# Altium schematic sheet Sheet2.SchDoc
size A4; SheetNumber: 1; SheetTotal: 1
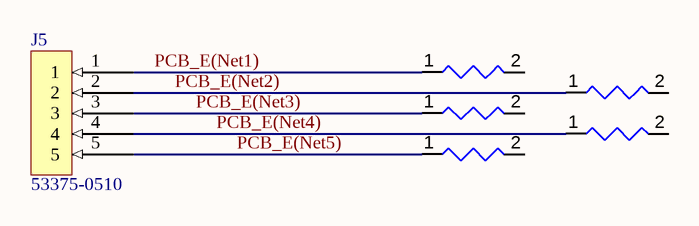
[diagram p0: Sheet2.SchDoc]

## Parts
J5  53375-0510  [53375-0510-Footprint-1]
R1  Resistor 10k +/-1% 1206 250 mW  [RESC3216X60X45ML15T20]  (value not drawn)
R2  Resistor 10k +/-1% 1206 250 mW  [RESC3216X60X45ML15T20]  (value not drawn)
R3  Resistor 10k +/-1% 1206 250 mW  [RESC3216X60X45ML15T20]  (value not drawn)
R4  Resistor 10k +/-1% 1206 250 mW  [RESC3216X60X45ML15T20]  (value not drawn)
R5  Resistor 10k +/-1% 1206 250 mW  [RESC3216X60X45ML15T20]  (value not drawn)

## Nets
PCB_E(Net1): J5.1 R1.1
PCB_E(Net2): J5.2 R2.1
PCB_E(Net3): J5.3 R3.1
PCB_E(Net4): J5.4 R4.1
PCB_E(Net5): J5.5 R5.1

Not connected (* = marked no-connect by the designer): R1 2; R2 2; R3 2; R4 2; R5 2

## Library data of the parts
J5 = CMP-002-00076-3: Board Connector, 5 Contact(s), 1 Row(s), Male, Straight, 0.098 inch Pitch, Solder Terminal, White Insulator, Receptacle; Manufacturer: Molex; Manufacturer Part Number: 53375-0510; Component Type: Connectors; System: Connector
R1-R5 = CMP-009-00016-5: Chip Resistor, 10 KOhm, +/- 1%, 0.25 W, -55 to 155 degC, 1206 (3216 Metric); Power: 250mW; Voltage Rating: 200V; Pins: 2; Max Operating Temperature: 155°C; Tolerance: 1%; Value: 10k; RoHS Compliant: True; Case/Package: 1206; Min Operating Temperature: -55°C; Mounting Technology: SM